# EAGLE design CP_Watsonville_South-Model (EAGLE 7.7.0)
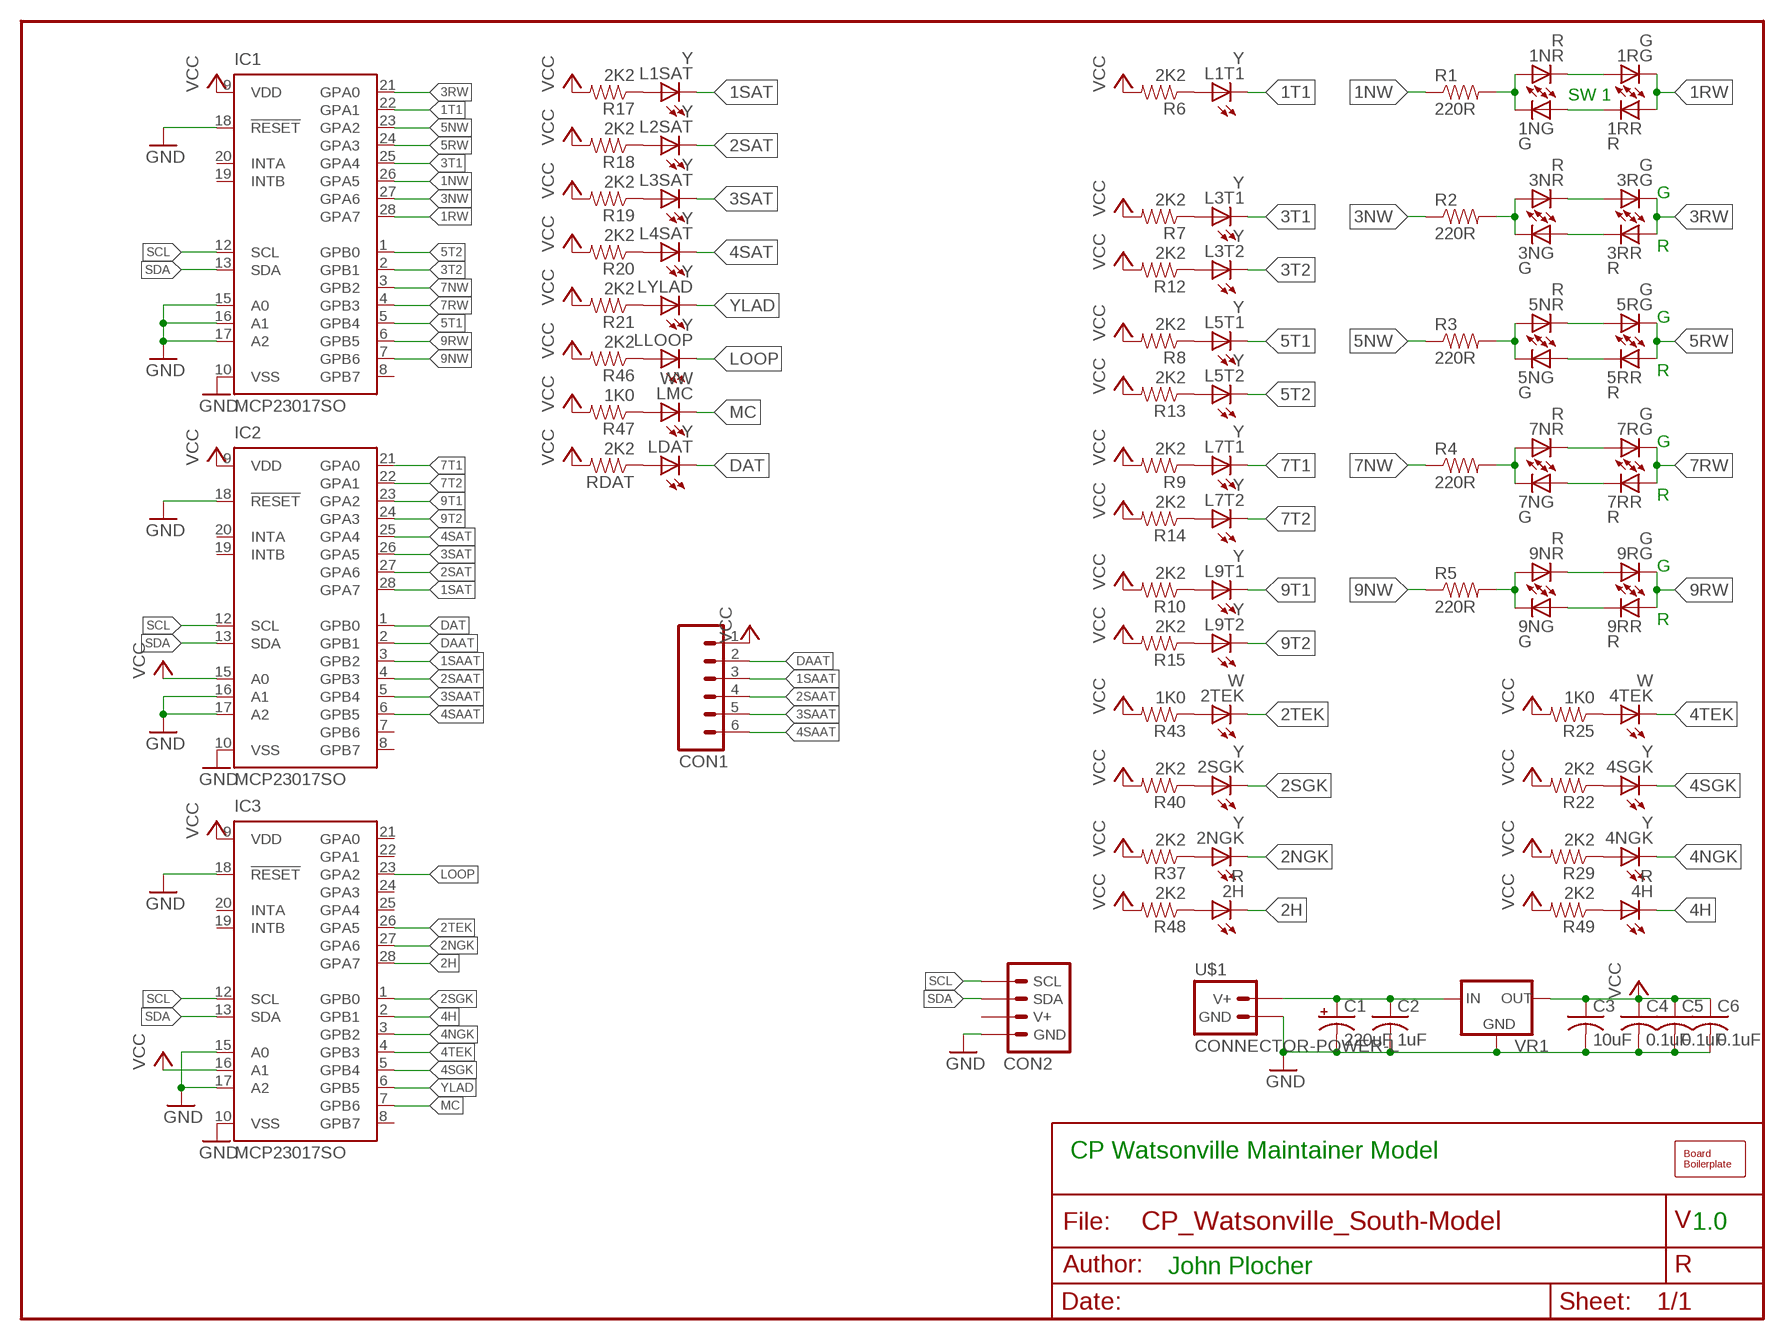
[diagram p0: schematic, sheet 1]

## Parts
1NG  G  LED0603-LED  [0603-LED]
1NR  R  LED0603-LED  [0603-LED]
1RG  G  LED0603-LED  [0603-LED]
1RR  R  LED0603-LED  [0603-LED]
2H  R  LED0603-LED  [0603-LED]
2NGK  Y  LED0603-LED  [0603-LED]
2SGK  Y  LED0603-LED  [0603-LED]
2TEK  W  LED0603-LED  [0603-LED]
3NG  G  LED0603-LED  [0603-LED]
3NR  R  LED0603-LED  [0603-LED]
3RG  G  LED0603-LED  [0603-LED]
3RR  R  LED0603-LED  [0603-LED]
4H  R  LED0603-LED  [0603-LED]
4NGK  Y  LED0603-LED  [0603-LED]
4SGK  Y  LED0603-LED  [0603-LED]
4TEK  W  LED0603-LED  [0603-LED]
5NG  G  LED0603-LED  [0603-LED]
5NR  R  LED0603-LED  [0603-LED]
5RG  G  LED0603-LED  [0603-LED]
5RR  R  LED0603-LED  [0603-LED]
7NG  G  LED0603-LED  [0603-LED]
7NR  R  LED0603-LED  [0603-LED]
7RG  G  LED0603-LED  [0603-LED]
7RR  R  LED0603-LED  [0603-LED]
9NG  G  LED0603-LED  [0603-LED]
9NR  R  LED0603-LED  [0603-LED]
9RG  G  LED0603-LED  [0603-LED]
9RR  R  LED0603-LED  [0603-LED]
BOARD1  BOARD100X150  [BOARD-SEEED10X15]
C1  220uF  CAP-POL0810  [0810-CAP]
C2  1uF  CAP0603  [0603-CAP]
C3  10uF  CAP0603  [0603-CAP]
C4  0.1uF  CAP0603  [0603-CAP]
C5  0.1uF  CAP0603  [0603-CAP]
C6  0.1uF  CAP0603  [0603-CAP]
CON1  CONNECTOR-M06LOCK  [1X06_LOCK]
CON2  CONNECTOR-I2CNOOUTLINE  [I2C-NOOUTLINE]
IC1  MCP23017SO  [SO28W]
IC2  MCP23017SO  [SO28W]
IC3  MCP23017SO  [SO28W]
L1SAT  Y  LED0603-LED  [0603-LED]
L1T1  Y  LED0603-LED  [0603-LED]
L2SAT  Y  LED0603-LED  [0603-LED]
L3SAT  Y  LED0603-LED  [0603-LED]
L3T1  Y  LED0603-LED  [0603-LED]
L3T2  Y  LED0603-LED  [0603-LED]
L4SAT  Y  LED0603-LED  [0603-LED]
L5T1  Y  LED0603-LED  [0603-LED]
L5T2  Y  LED0603-LED  [0603-LED]
L7T1  Y  LED0603-LED  [0603-LED]
L7T2  Y  LED0603-LED  [0603-LED]
L9T1  Y  LED0603-LED  [0603-LED]
L9T2  Y  LED0603-LED  [0603-LED]
LDAT  Y  LED0603-LED  [0603-LED]
LLOOP  Y  LED0603-LED  [0603-LED]
LMC  WW  LED0603-LED  [0603-LED]
LYLAD  Y  LED0603-LED  [0603-LED]
R1  220R  R0603-RES  [0603-RES]
R2  220R  R0603-RES  [0603-RES]
R3  220R  R0603-RES  [0603-RES]
R4  220R  R0603-RES  [0603-RES]
R5  220R  R0603-RES  [0603-RES]
R6  2K2  R0603-RES  [0603-RES]
R7  2K2  R0603-RES  [0603-RES]
R8  2K2  R0603-RES  [0603-RES]
R9  2K2  R0603-RES  [0603-RES]
R10  2K2  R0603-RES  [0603-RES]
R12  2K2  R0603-RES  [0603-RES]
R13  2K2  R0603-RES  [0603-RES]
R14  2K2  R0603-RES  [0603-RES]
R15  2K2  R0603-RES  [0603-RES]
R17  2K2  R0603-RES  [0603-RES]
R18  2K2  R0603-RES  [0603-RES]
R19  2K2  R0603-RES  [0603-RES]
R20  2K2  R0603-RES  [0603-RES]
R21  2K2  R0603-RES  [0603-RES]
R22  2K2  R0603-RES  [0603-RES]
R25  1K0  R0603-RES  [0603-RES]
R29  2K2  R0603-RES  [0603-RES]
R37  2K2  R0603-RES  [0603-RES]
R40  2K2  R0603-RES  [0603-RES]
R43  1K0  R0603-RES  [0603-RES]
R46  2K2  R0603-RES  [0603-RES]
R47  1K0  R0603-RES  [0603-RES]
R48  2K2  R0603-RES  [0603-RES]
R49  2K2  R0603-RES  [0603-RES]
RDAT  2K2  R0603-RES  [0603-RES]
U$1  CONNECTOR-POWER-L  [POWER-R2]
VR1  VREG-DPAK-5  [TO-252]

## Nets
1NW: IC1.26(GPA5) R1.1
1RW: 1RG.C 1RR.A IC1.28(GPA7)
1SAAT: CON1.3 IC2.3(GPB2)
1SAT: IC2.28(GPA7) L1SAT.C
1T1: IC1.22(GPA1) L1T1.C
2H: 2H.C IC3.28(GPA7)
2NGK: 2NGK.C IC3.27(GPA6)
2SAAT: CON1.4 IC2.4(GPB3)
2SAT: IC2.27(GPA6) L2SAT.C
2SGK: 2SGK.C IC3.1(GPB0)
2TEK: 2TEK.C IC3.26(GPA5)
3NW: IC1.27(GPA6) R2.1
3RW: 3RG.C 3RR.A IC1.21(GPA0)
3SAAT: CON1.5 IC2.5(GPB4)
3SAT: IC2.26(GPA5) L3SAT.C
3T1: IC1.25(GPA4) L3T1.C
3T2: IC1.2(GPB1) L3T2.C
4H: 4H.C IC3.2(GPB1)
4NGK: 4NGK.C IC3.3(GPB2)
4SAAT: CON1.6 IC2.6(GPB5)
4SAT: IC2.25(GPA4) L4SAT.C
4SGK: 4SGK.C IC3.5(GPB4)
4TEK: 4TEK.C IC3.4(GPB3)
5NW: IC1.23(GPA2) R3.1
5RW: 5RG.C 5RR.A IC1.24(GPA3)
5T1: IC1.5(GPB4) L5T1.C
5T2: IC1.1(GPB0) L5T2.C
7NW: IC1.3(GPB2) R4.1
7RW: 7RG.C 7RR.A IC1.4(GPB3)
7T1: IC2.21(GPA0) L7T1.C
7T2: IC2.22(GPA1) L7T2.C
9NW: IC1.7(GPB6) R5.1
9RW: 9RG.C 9RR.A IC1.6(GPB5)
9T1: IC2.23(GPA2) L9T1.C
9T2: IC2.24(GPA3) L9T2.C
DAAT: CON1.2 IC2.2(GPB1)
DAT: IC2.1(GPB0) LDAT.C
GND [power]: C1.- C2.2 C3.2 C4.2 C5.2 C6.2 CON2.GND IC1.10(VSS) IC1.15(A0) IC1.16(A1) IC1.17(A2) IC1.18(!RESET) IC2.10(VSS) IC2.16(A1) IC2.17(A2) IC2.18(!RESET) IC3.10(VSS) IC3.15(A0) IC3.17(A2) IC3.18(!RESET) U$1.GND U$1.GND@1(GND) U$1.GND@2(GND) U$1.GND@3(GND) VR1.2(GND)
LOOP: IC3.23(GPA2) LLOOP.C
MC: IC3.7(GPB6) LMC.C
N$1: 3NR.C 3RG.A
N$2: 3NG.A 3RR.C
N$3: 1NG.C 1NR.A R1.2
N$4: L1T1.A R6.1
N$5: L3T1.A R7.1
N$8: 3NG.C 3NR.A R2.2
N$11: 5NG.C 5NR.A R3.2
N$14: 7NG.C 7NR.A R4.2
N$17: 9NG.C 9NR.A R5.2
N$18: L5T1.A R8.1
N$19: L7T1.A R9.1
N$20: L9T1.A R10.1
N$21: 1NR.C 1RG.A
N$22: L3T2.A R12.1
N$23: L5T2.A R13.1
N$24: L7T2.A R14.1
N$25: L9T2.A R15.1
N$26: LDAT.A RDAT.1
N$27: L1SAT.A R17.1
N$28: L2SAT.A R18.1
N$29: L3SAT.A R19.1
N$30: L4SAT.A R20.1
N$31: LYLAD.A R21.1
N$32: 4SGK.A R22.1
N$33: 1NG.A 1RR.C
N$34: 5NR.C 5RG.A
N$35: 4TEK.A R25.1
N$36: 5NG.A 5RR.C
N$37: 7NR.C 7RG.A
N$38: 7NG.A 7RR.C
N$39: 4NGK.A R29.1
N$40: 9NR.C 9RG.A
N$41: 9NG.A 9RR.C
N$47: 2NGK.A R37.1
N$50: 2SGK.A R40.1
N$53: 2TEK.A R43.1
N$56: LLOOP.A R46.1
N$57: LMC.A R47.1
N$58: 2H.A R48.1
N$59: 4H.A R49.1
SCL: CON2.SCL IC1.12(SCL) IC2.12(SCL) IC3.12(SCL)
SDA: CON2.SDA IC1.13(SDA) IC2.13(SDA) IC3.13(SDA)
VCC [power]: C3.1 C4.1 C5.1 C6.1 CON1.1 IC1.9(VDD) IC2.9(VDD) IC2.15(A0) IC3.9(VDD) IC3.16(A1) R6.2 R7.2 R8.2 R9.2 R10.2 R12.2 R13.2 R14.2 R15.2 R17.2 R18.2 R19.2 R20.2 R21.2 R22.2 R25.2 R29.2 R37.2 R40.2 R43.2 R46.2 R47.2 R48.2 R49.2 RDAT.2 VR1.3(OUT)
VIN [power]: C1.+ C2.1 U$1.V+ U$1.V+@1(V+) U$1.V+@2(V+) U$1.V+@3(V+) VR1.1(IN)
YLAD: IC3.6(GPB5) LYLAD.C
Unconnected: CON2.V+ IC1.8(GPB7) IC1.19(INTB) IC1.20(INTA) IC2.7(GPB6) IC2.8(GPB7) IC2.19(INTB) IC2.20(INTA) IC3.8(GPB7) IC3.19(INTB) IC3.20(INTA) IC3.21(GPA0) IC3.22(GPA1) IC3.24(GPA3) IC3.25(GPA4)

## Notes on the sheet
- SW 1
- G
- R
- G
- R
- G
- R
- G
- R
- CP Watsonville Maintainer Model
- 1.0
- John Plocher

## Library data of the parts
1NG 1NR 1RG 1RR 2H 2NGK 2SGK 2TEK 3NG 3NR 3RG 3RR 4H 4NGK 4SGK 4TEK 5NG 5NR 5RG 5RR 7NG 7NR 7RG 7RR 9NG 9NR 9RG 9RR L1SAT L1T1 L2SAT L3SAT L3T1 L3T2 L4SAT L5T1 L5T2 L7T1 L7T2 L9T1 L9T2 LDAT LLOOP LMC LYLAD = SPCoast:LED*
BOARD1 = SPCoast:BOARD
C1 = SPCoast:CAP-POL*
C2-C6 = SPCoast:CAP*
CON1 = SPCoast:CONNECTOR-M06: Header 6 Standard 6-pin 0.1" header
CON2 = SPCoast:CONNECTOR-I2C
IC1-IC3 = SPCoast:MCP23017: http://ww1.microchip.com/downloads/en/DeviceDoc/21952a.pdf Source: http://ww1.microchip.com/downloads/en/DeviceDoc/21952a.pdf; MF: MICROCHIP; MPN: MCP23017-E/SO; OC_FARNELL: 1332087; OC_NEWARK: 31K2958
R1-R10 R12-R15 R17-R22 R25 R29 R37 R40 R43 R46-R49 RDAT = SPCoast:R*: Resistor Basic schematic elements and footprints for 0603, 1206, and PTH 1/10th watt (small) resistors.
U$1 = SPCoast:CONNECTOR-POWER
VR1 = SPCoast:VREG-?-*: Voltage Regulator Standard linear regulator. 7805 uses IGO pinout LM1117 uses GOI pinout

## Net classes
0 default: width 0.152 mm, drill 0.4 mm
1 power: width 0.61 mm, drill 1 mm

## Board
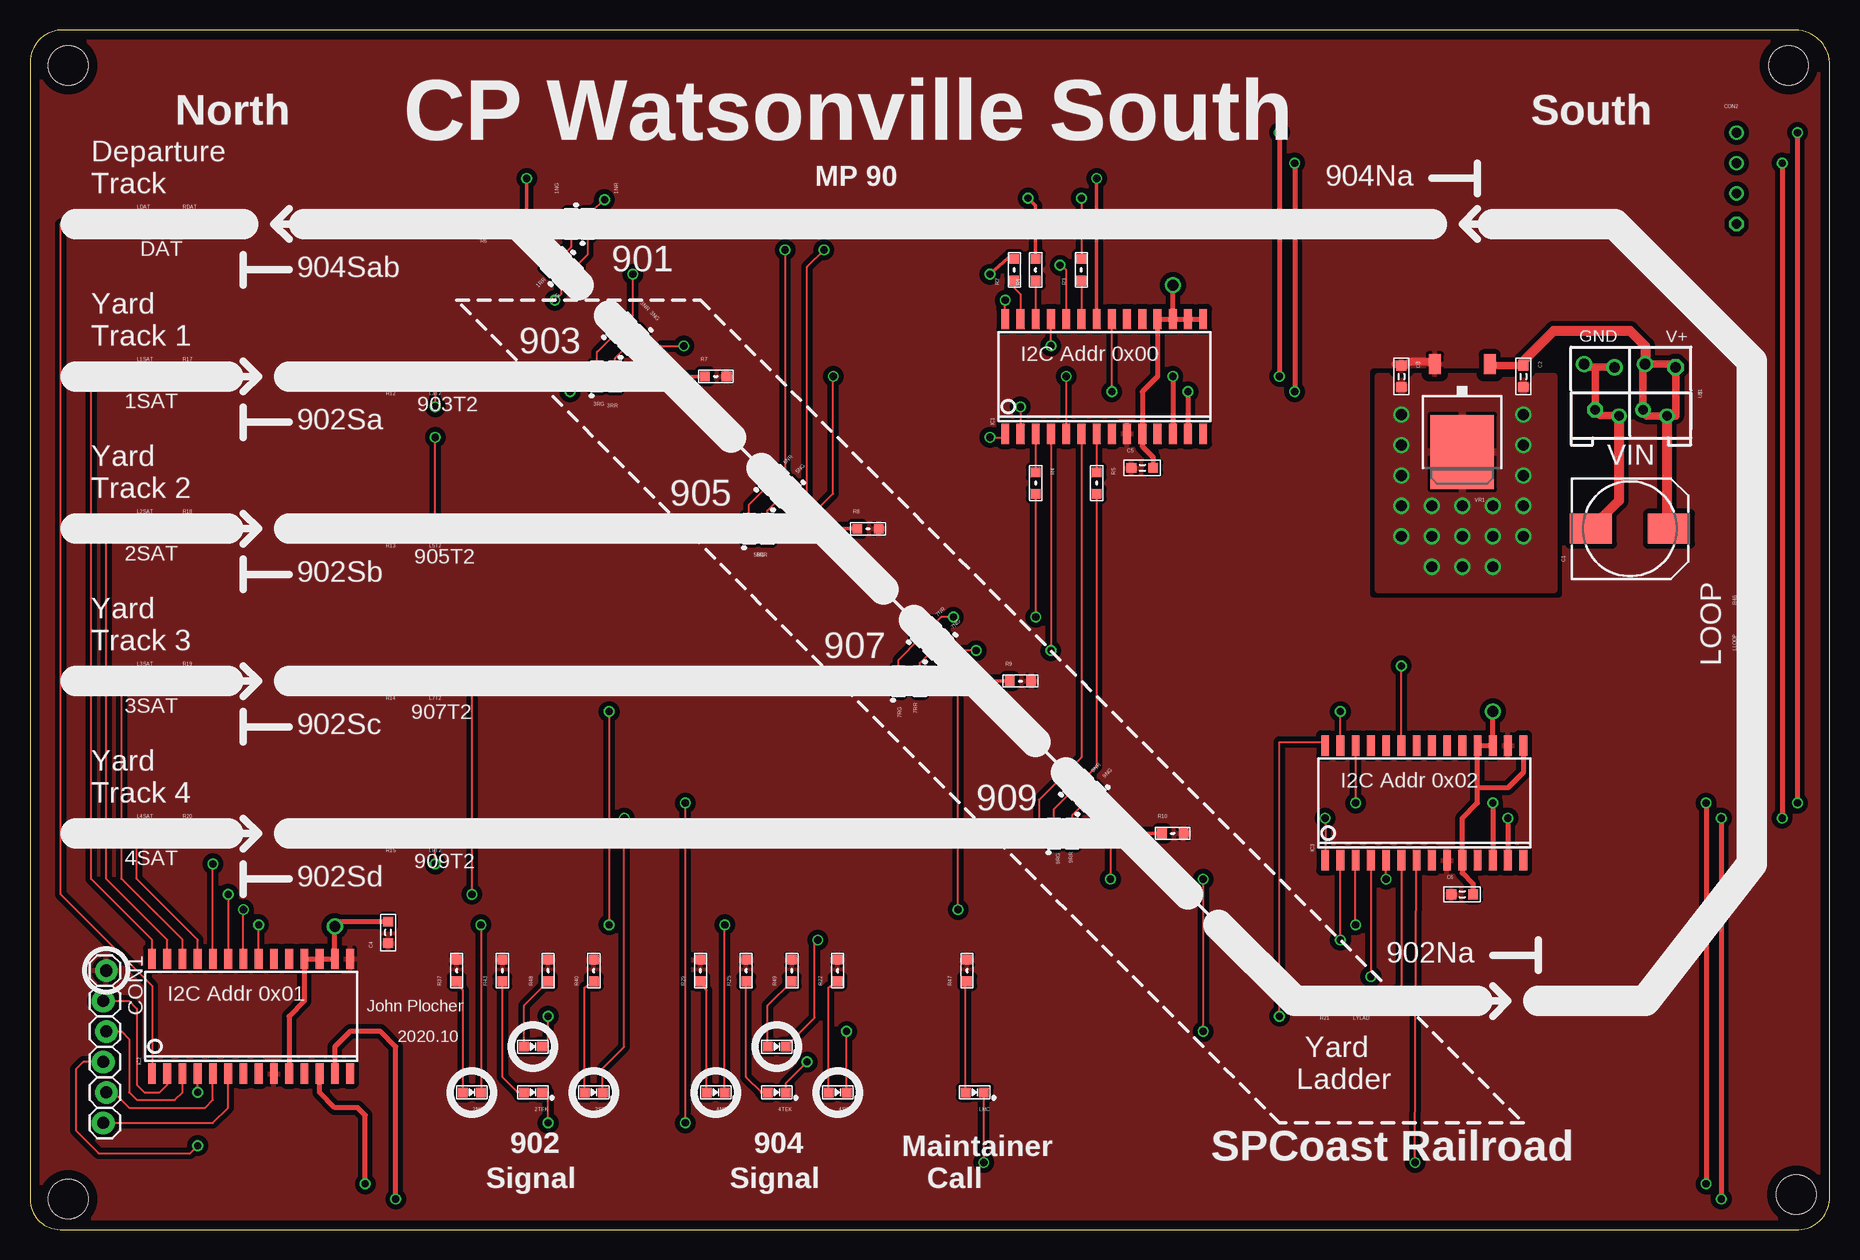
[diagram p1: board, top side]
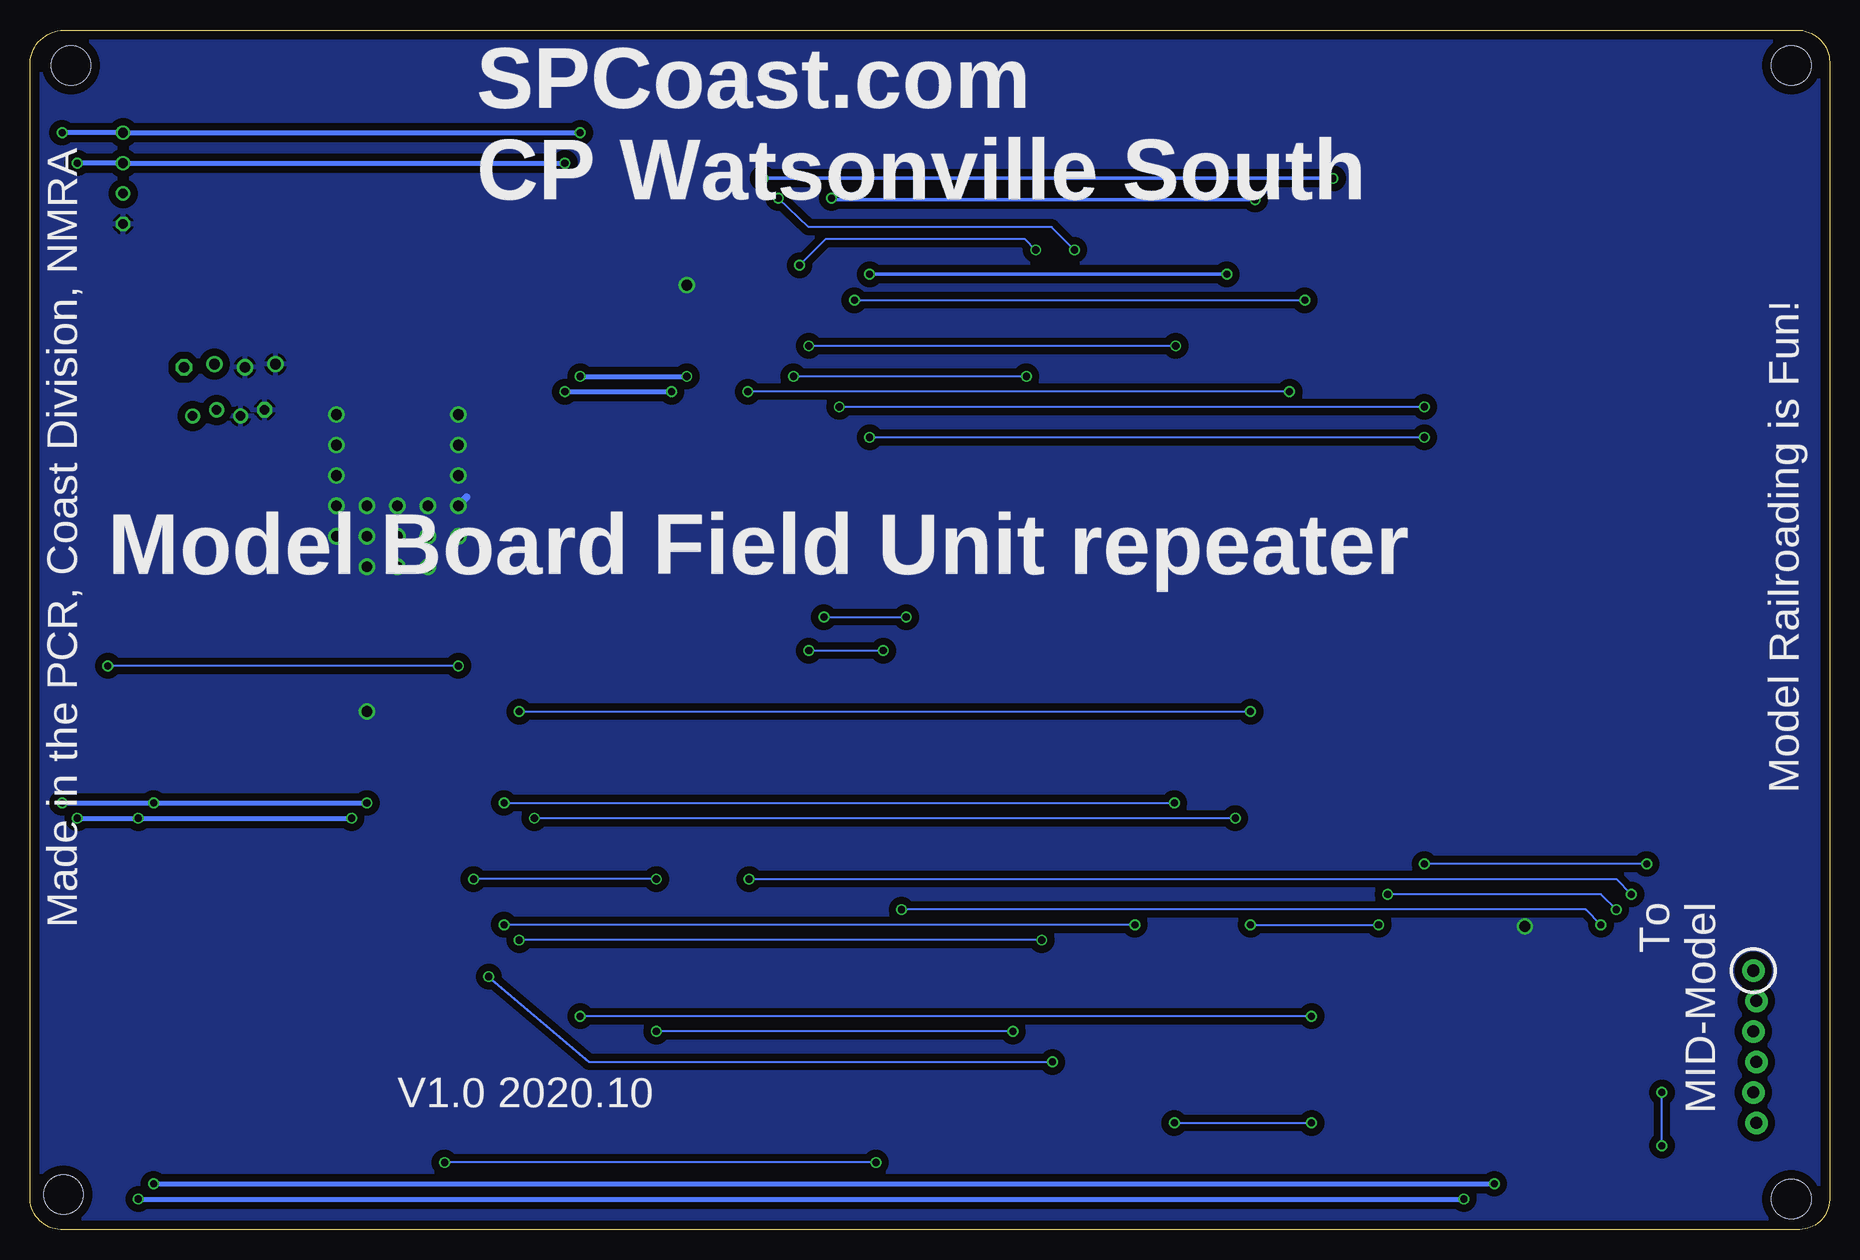
[diagram p2: board, bottom side, seen from below]

Size 150.01 x 100 mm. Coordinates in mm from the lower left corner, seen from the top.
Copper layers (1*16): Top 0.035mm / dielectric 1.5mm / Bottom 0.035mm
Design rules "jlcpcb *": minimum track width 5mil, minimum drill 0.3mm, track to track 5mil, track to pad 0.2mm, pad to pad 0.54mm, via to via 0.54mm, smd to smd 5mil, copper to edge 30mil, drill to drill 10mil, minimum pad ring 0.13mm, minimum via ring 0.13mm, stop-mask expansion 4mil, vias tented up to drill 0mil, thermal gap 10mil

### Footprints (pad centres in the part's own frame; a part is rotated, then mirrored left to right if it is on the bottom)
0603-LED = smd 0.8 x 0.8: A 0.75,0; C -0.75,0
BOARD-SEEED10X15 = hole 3.3: 147.216,2.921; 3.175,97.04; 146.581,97.04; 3.175,2.54
0810-CAP = smd 3.5 x 2.5: + 3.25,0; - -3.25,0
0603-CAP = smd 0.813 x 0.813: 1 -0.9,0; 2 0.9,0
1X06_LOCK = drill 1.016 pad 1.88: 1 0,0; 2 2.54,-0.254; 3 5.08,0; 4 7.62,-0.254; 5 10.16,0; 6 12.7,-0.254
I2C-NOOUTLINE = drill 0.8 octagon: GND 3.81,0 | drill 0.8: SCL -3.81,0; SDA -1.27,0; V+ 1.27,0
SO28W = smd 0.65 x 1.7: 1 -7.62,-4.78; 2 -6.35,-4.78; 3 -5.08,-4.78; 4 -3.81,-4.78; 5 -2.54,-4.78; 6 -1.27,-4.78; 7 0,-4.78; 8 1.27,-4.78; 9 2.54,-4.78; 10 3.81,-4.78; 11 5.08,-4.78; 12 6.35,-4.78; 13 7.62,-4.78; 14 8.89,-4.78; 15 8.89,4.78; 16 7.62,4.78; 17 6.35,4.78; 18 5.08,4.78; 19 3.81,4.78; 20 2.54,4.78; 21 1.27,4.78; 22 0,4.78; 23 -1.27,4.78; 24 -2.54,4.78; 25 -3.81,4.78; 26 -5.08,4.78; 27 -6.35,4.78; 28 -7.62,4.78
0603-RES = smd 0.813 x 0.813: 1 -0.9,0; 2 0.9,0
POWER-R2 = drill 0.9: GND -3.302,-1.27; GND@1 -3.556,-3.81; V+ -3.556,1.27 | drill 0.8 pad 1.27: GND@2 0.762,-0.904; V+@2 0.762,3.096; V+@3 0.254,1.096 | drill 0.8 pad 1.27 octagon: GND@3 0.254,-2.904 | drill 0.9 octagon: V+@1 -3.302,3.81
TO-252 = smd 1.651 x 1.016: 1 -4.826,2.286; 3 -4.826,-2.286 | smd 6.2 x 5.3: 2 2.5,0

### Placement (x,y rotation side)
1NG  45.09,83.82 270 top
1NR  46.49,83.82 90 top
1RG  44.84,79.63 45 top
1RR  43.82,80.65 225 top
2H  41.92,15.24 180 top
2NGK  36.84,11.43 180 top
2SGK  47,11.43 180 top
2TEK  41.92,11.43 180 top
3NG  50.3,74.17 225 top
3NR  49.29,75.19 45 top
3RG  47.25,71.12 90 top
3RR  48.78,71.12 270 top
4H  62.24,15.24 180 top
4NGK  57.16,11.43 180 top
4SGK  67.32,11.43 180 top
4TEK  62.24,11.43 180 top
5NG  63,61.47 225 top
5NR  61.99,62.49 45 top
5RG  59.95,58.42 90 top
5RR  61.48,58.42 270 top
7NG  75.7,48.77 225 top
7NR  74.69,49.79 45 top
7RG  72.4,45.72 90 top
7RR  74.18,45.72 270 top
9NG  88.4,36.07 225 top
9NR  87.39,37.09 45 top
9RG  85.35,33.02 90 top
9RR  86.88,33.02 270 top
BOARD1  0.01,0 0 top
C1  133.36,58.42 0 top
C2  124.47,71.12 270 top
C3  114.31,71.12 270 top
C4  29.85,24.77 90 top
C5  92.72,63.5 0 top
C6  119.39,27.94 0 top
CON1  6.36,21.59 270 top
CON2  142.25,87.63 270 top
IC1  88.91,71.12 0 top
IC2  17.79,17.78 0 top
IC3  115.58,35.56 0 top
L1SAT  10.17,71.12 0 top
L1T1  40.65,83.82 180 top
L2SAT  10.17,58.42 0 top
L3SAT  10.17,45.72 0 top
L3T1  52.71,71.12 0 top
L3T2  33.03,71.12 180 top
L4SAT  10.17,33.02 0 top
L5T1  65.41,58.42 0 top
L5T2  33.03,58.42 180 top
L7T1  78.11,45.72 0 top
L7T2  33.03,45.72 180 top
L9T1  90.81,33.02 0 top
L9T2  33.03,33.02 180 top
LDAT  10.17,83.82 0 top
LLOOP  143.52,49.53 90 top
LMC  78.75,11.43 180 top
LYLAD  110.37,19.05 180 top
R1  83.83,80.01 90 top
R2  82.05,80.01 90 top
R3  87.64,80.01 90 top
R4  83.83,62.23 270 top
R5  88.91,62.23 270 top
R6  36.84,83.82 180 top
R7  57.16,71.12 0 top
R8  69.86,58.42 0 top
R9  82.56,45.72 0 top
R10  95.26,33.02 0 top
R12  29.22,71.12 180 top
R13  29.22,58.42 180 top
R14  29.22,45.72 180 top
R15  29.22,33.02 180 top
R17  13.98,71.12 0 top
R18  13.98,58.42 0 top
R19  13.98,45.72 0 top
R20  13.98,33.02 0 top
R21  107.07,19.05 180 top
R22  67.32,21.59 90 top
R25  59.7,21.59 90 top
R29  55.89,21.59 90 top
R37  35.57,21.59 90 top
R40  47,21.59 90 top
R43  39.38,21.59 90 top
R46  143.52,53.34 90 top
R47  78.11,21.59 90 top
R48  43.19,21.59 90 top
R49  63.51,21.59 90 top
RDAT  13.98,83.82 0 top
U$1  133.36,68.58 270 top
VR1  119.39,67.31 270 top

### Tracks (layer width: path | path; a pad name or v marks a point on that pad's centre or on a via)
1NW
  Top 0.152: R1.1 IC1.26
1RW  (via drill 0.6)
  Top 0.152: IC1.28 v81.29,77.47 | 1RR.A 1RG.C 44.31,78.03 v43.75,77.47
  Bottom 0.152: v81.29,77.47 v43.75,77.47
1SAAT
  Top 0.152: CON1.3 7.63,16.51 8.26,15.88 8.26,11.43 8.9,10.8 12.07,10.8 12.71,11.43 IC2.3
1SAT
  Top 0.152: IC2.28 10.17,24.13 5.09,29.21 5.09,71.12 L1SAT.C
1T1  (via drill 0.6)
  Top 0.305: L1T1.C v41.4,87.63 | v88.91,87.63 IC1.22
  Bottom 0.305: v41.4,87.63 v88.91,87.63
2H  (via drill 0.6)
  Top 0.152: 2H.C 43.19,15.24 v43.19,17.78 | v104.15,17.78 104.15,40.64 107.96,40.64 IC3.28
  Bottom 0.152: v43.19,17.78 v104.15,17.78
2NGK  (via drill 0.6)
  Top 0.152: IC3.27 v109.23,43.18 | v48.27,43.18 v48.27,25.4 | v37.59,25.4 2NGK.C
  Bottom 0.152: v109.23,43.18 v48.27,43.18 | v48.27,25.4 v37.59,25.4
2SAAT  (via drill 0.6)
  Top 0.152: CON1.4 4.45,13.97 3.82,13.34 3.82,8.26 5.72,6.35 13.34,6.35 v13.98,6.99 | v13.98,11.43 IC2.4
  Bottom 0.152: v13.98,6.99 v13.98,11.43
2SAT
  Top 0.152: IC2.27 11.44,24.13 6.36,29.21 6.36,58.42 L2SAT.C
2SGK  (via drill 0.6)
  Top 0.152: 2SGK.C 47.75,13.45 49.54,15.24 v49.54,34.29 | v107.96,34.29 IC3.1
  Bottom 0.152: v49.54,34.29 v107.96,34.29
2TEK  (via drill 0.6)
  Top 0.152: IC3.26 v110.5,35.56 | v54.62,35.56 v54.62,8.89 | v43.19,8.89 43.19,11.43 2TEK.C
  Bottom 0.152: v110.5,35.56 v54.62,35.56 | v54.62,8.89 v43.19,8.89
3NW
  Top 0.152: R2.1 82.05,78.49 82.56,77.98 IC1.27
3RW  (via drill 0.6)
  Top 0.152: v90.18,69.85 IC1.21 | v45.02,69.85 45.54,70.37 3RG.C 3RR.A
  Bottom 0.152: v45.02,69.85 v90.18,69.85
3SAAT
  Top 0.152: CON1.5 6.99,11.43 8.26,10.16 14.61,10.16 15.25,10.8 IC2.5
3SAT
  Top 0.152: IC2.26 12.71,24.13 7.63,29.21 7.63,45.72 L3SAT.C
3T1  (via drill 0.6)
  Top 0.152: L3T1.C 51.96,73.04 52.59,73.66 v54.5,73.66 | v85.1,73.66 IC1.25
  Bottom 0.152: v54.5,73.66 v85.1,73.66
3T2  (via drill 0.6)
  Top 0.152: L3T2.C v33.78,68.58 | v82.56,68.58 IC1.2
  Bottom 0.152: v33.78,68.58 v82.56,68.58
4H  (via drill 0.6)
  Top 0.152: 4H.C 65.41,17.67 65.41,23.88 v65.67,24.13 | v109.23,24.13 IC3.2
  Bottom 0.152: v65.67,24.13 v109.23,24.13
4NGK  (via drill 0.6)
  Top 0.152: 4NGK.C v57.91,25.4 | v110.5,25.4 IC3.3
  Bottom 0.152: v57.91,25.4 v110.5,25.4
4SAAT
  Top 0.152: CON1.6 15.25,8.89 16.52,10.16 IC2.6
4SAT
  Top 0.152: IC2.25 13.98,24.13 8.9,29.21 8.9,33.02
  Top 0.305: 8.9,33.02 L4SAT.C
4SGK  (via drill 0.6)
  Top 0.152: 4SGK.C v68.07,16.51 | v97.8,16.51 v97.8,29.21 | v113.04,29.21 IC3.5
  Bottom 0.152: v68.07,16.51 v97.8,16.51 | v97.8,29.21 v113.04,29.21
4TEK  (via drill 0.6)
  Top 0.152: IC3.4 v111.77,21.09 | v64.78,13.97 62.99,12.18 4TEK.C
  Bottom 0.152: v111.77,21.09 103.39,13.97 v64.78,13.97
5NW
  Top 0.152: R3.1 IC1.23
5RW  (via drill 0.6)
  Top 0.152: v66.18,81.66 64.78,80.27 64.78,61.22 62.75,59.19 62.75,58.17 62.24,57.66 61.49,57.66 5RR.A 5RG.C | v85.86,80.39 85.99,80.39 86.37,80.01 IC1.24
  Bottom 0.152: v66.18,81.66 67.07,82.55 83.7,82.55 v85.86,80.39
5T1  (via drill 0.6)
  Top 0.152: L5T1.C 64.65,58.44 64.65,59.06 66.94,61.34 v66.95,71.12 | v86.37,71.12 IC1.5
  Bottom 0.152: v66.95,71.12 v86.37,71.12
5T2  (via drill 0.6)
  Top 0.152: L5T2.C v33.78,66.04 | v80.02,66.04 81.29,66.04
  Top 0.305: 81.29,66.04 IC1.1
  Bottom 0.152: v33.78,66.04 v80.02,66.04
7NW
  Top 0.152: IC1.3 R4.1
7RW  (via drill 0.6)
  Top 0.152: IC1.4 v85.1,48.26 | v78.88,48.26 77.48,48.26 75.45,46.23 75.45,45.47 74.95,44.97 7RR.A 7RG.C
  Bottom 0.152: v85.1,48.26 v78.88,48.26
7T1  (via drill 0.6)
  Top 0.152: IC2.21 v19.06,25.4 | v77.36,26.67 L7T1.C
  Bottom 0.152: v19.06,25.4 20.33,26.67 v77.36,26.67
7T2  (via drill 0.6)
  Top 0.152: IC2.22 v17.79,26.67 | v36.84,27.94 36.84,45.72 L7T2.C
  Bottom 0.152: v17.79,26.67 19.06,27.94 v36.84,27.94
9NW
  Top 0.152: IC1.7 R5.1
9RW
  Top 0.152: IC1.6 87.64,39.37 84.08,35.82 84.08,32.77 84.59,32.26 85.34,32.26 9RG.C 9RR.A
9T1  (via drill 0.6)
  Top 0.152: L9T1.C v90.06,29.21 | v16.52,27.94 IC2.23
  Bottom 0.152: v90.06,29.21 17.79,29.21 v16.52,27.94
9T2  (via drill 0.6)
  Top 0.152: IC2.24 v15.25,30.48 | v33.78,30.48 L9T2.C
  Bottom 0.152: v15.25,30.48 v33.78,30.48
DAAT
  Top 0.152: CON1.2 8.26,19.05 8.9,18.42 8.9,12.07 9.53,11.43 10.8,11.43 11.44,12.07 IC2.2
DAT
  Top 0.152: LDAT.C 2.55,83.82 2.55,27.94 10.17,20.32 IC2.1
GND  (via drill 0.9)
  Top 0.406: IC1.17 IC1.18 93.99,71.12 92.72,69.85 IC1.10 92.72,65.28 93.61,64.39 93.61,63.51 C5.2 | IC1.17 IC1.16 IC1.15 | IC2.10 21.6,17.78 22.87,19.05 IC2.18 IC2.17 IC2.16 v25.41,25.28 25.8,25.67 C4.2 | 120.66,36.83 120.66,35.56 119.39,34.29 IC3.10 119.39,29.72 120.28,28.83 120.28,27.95 C6.2 | 120.66,36.83 IC3.18 IC3.17 v121.93,43.18 | IC3.15 124.47,38.1 123.2,36.83 120.66,36.83 | IC1.17 v95.26,78.74
  Top 0.61: C2.2 124.66,70.41 | U$1.GND@2 132.45,67.86 130.91,67.86 130.49,68.28 U$1.GND@3 130.49,68.63 130.49,71.91 | 130.49,71.91 129.79,71.91 129.58,72.12 U$1.GND@1 | 130.49,71.91 132.03,71.91 U$1.GND
  Top 0.813: U$1.GND@2 132.46,60.77 C1.-
  Bottom 0.61: 113.6,61.06 114.3,60.36 v114.31,60.33
  other vias: 114.31,67.95 114.31,65.41 114.31,62.87 116.85,60.33 119.39,60.33 121.93,60.33 124.47,60.33 124.47,62.87 124.47,65.41 124.47,67.95 124.47,57.79 121.93,55.25 121.93,57.79 119.39,57.79 116.85,57.79 114.31,57.79 119.39,55.25 116.85,55.25
  pour Bottom (isolate 0.61): 0.01,100.33 0.01,0 149.87,0 149.87,100.33
  pour Top (isolate 0.61): 127.01,71.12 112.4,71.12 112.4,53.34 127.01,53.34
LOOP  (via drill 0.6)
  Top 0.152: IC3.23 v114.31,46.99 | v143.52,46.99 LLOOP.C
  Bottom 0.152: v114.31,46.99 v143.52,46.99
MC  (via drill 0.6)
  Top 0.152: 79.52,11.39 LMC.C v79.5,5.59 | v115.45,5.59 IC3.7
  Bottom 0.152: v79.5,5.59 v115.45,5.59
N$1
  Top 0.152: 3RG.A 47.25,73.16 3NR.C
N$2
  Top 0.152: 3RR.C 48.78,72.65 3NG.A
N$3  (via drill 0.6)
  Top 0.152: 1NG.C 1NR.A 46.76,84.84 v47.89,85.86
  Top 0.305: R1.2 83.83,85.35 v83.19,85.98
  Bottom 0.305: v47.89,85.86 83.07,85.86 v83.19,85.98
N$4
  Top 0.305: R6.1 L1T1.A
N$5
  Top 0.305: L3T1.A R7.1
N$8  (via drill 0.6)
  Top 0.152: 3NG.C 3NR.A 50.25,76.15 v50.25,79.64
  Top 0.305: v80.02,79.64 81.54,81.03 81.94,81.03 R2.2
  Bottom 0.305: v50.25,79.64 v80.02,79.64
N$11  (via drill 0.6)
  Top 0.152: v87.64,85.98 R3.2 | v62.95,81.66 62.95,63.45 5NR.A 5NG.C
  Bottom 0.152: v62.95,81.66 64.85,83.57 85.1,83.57 v87.64,85.98
N$14  (via drill 0.6)
  Top 0.152: R4.2 v83.83,51.06 | 7NG.C 7NR.A 75.96,51.06 v76.97,51.06
  Bottom 0.152: v83.83,51.06 v76.97,51.06
N$17
  Top 0.152: R5.2 88.91,38.61 9NR.A 9NG.C
N$18
  Top 0.305: L5T1.A R8.1
N$19
  Top 0.305: L7T1.A R9.1
N$20
  Top 0.305: L9T1.A R10.1
N$21
  Top 0.152: 1NR.C 46.49,81.28 1RG.A
N$22
  Top 0.305: R12.1 L3T2.A
N$23
  Top 0.305: R13.1 L5T2.A
N$24
  Top 0.305: R14.1 L7T2.A
N$25
  Top 0.305: R15.1 L9T2.A
N$26
  Top 0.305: LDAT.A RDAT.1
N$27
  Top 0.305: R17.1 L1SAT.A
N$28
  Top 0.305: R18.1 L2SAT.A
N$29
  Top 0.305: R19.1 L3SAT.A
N$30
  Top 0.305: R20.1 L4SAT.A
N$31
  Top 0.152: R21.1 LYLAD.A
N$32
  Top 0.152: 4SGK.A 66.57,20.17 R22.1
N$33
  Top 0.152: 1NG.A 45.09,81.92 1RR.C
N$34
  Top 0.152: 5RG.A 59.95,60.46 5NR.C
N$35
  Top 0.152: 60.97,11.43 59.7,12.7 R25.1
  Top 0.254: 4TEK.A 60.97,11.43
N$36
  Top 0.152: 5RR.C 61.48,59.95 5NG.A
N$37
  Top 0.152: 7RG.A 72.4,47.5 7NR.C
N$38
  Top 0.152: 7RR.C 74.18,47.25 7NG.A
N$39
  Top 0.152: 4NGK.A 56.41,19.94 R29.1
N$40
  Top 0.152: 9RG.A 85.35,35.06 9NR.C
N$41
  Top 0.152: 9RR.C 86.88,34.55 9NG.A
N$47
  Top 0.152: 2NGK.A 36.09,19.94 R37.1
N$50
  Top 0.152: 2SGK.A 46.25,20.17 R40.1
N$53
  Top 0.152: 40.65,11.43 39.38,12.7 R43.1
  Top 0.254: 2TEK.A 40.65,11.43
N$56
  Top 0.152: R46.1 LLOOP.A
N$57
  Top 0.152: LMC.A 78,20.58
  Top 0.254: 78,20.58 R47.1
N$58
  Top 0.152: 2H.A 41.17,18.67 R48.1
N$59
  Top 0.152: 4H.A 61.49,18.67 R49.1
SCL  (via drill 0.6)
  Top 0.406: v104.15,91.44 v104.15,71.12 | v95.26,71.12 IC1.12 | v121.93,35.56 IC3.12 | v139.71,35.56 v139.71,3.81 | v27.95,3.81 27.95,9.53 27.31,10.16 25.41,10.16 24.14,11.43 IC2.12 | v147.33,91.44 v147.33,35.56
  Bottom 0.406: v104.15,91.44 CON2.SCL v147.33,91.44 | v104.15,71.12 v95.26,71.12 | v121.93,35.56 v139.71,35.56 v147.33,35.56 | v139.71,3.81 v27.95,3.81
SDA  (via drill 0.6)
  Top 0.406: v105.42,88.9 v105.42,69.85 | v96.53,69.85 IC1.13 | v123.2,34.29 IC3.13 | v140.98,34.29 v140.98,2.54 | v30.49,2.54 30.49,15.24 29.22,16.51 26.68,16.51 25.41,15.24 IC2.13 | v146.06,88.9 v146.06,34.29
  Bottom 0.406: v105.42,88.9 CON2.SDA v146.06,88.9 | v105.42,69.85 v96.53,69.85 | v123.2,34.29 v140.98,34.29 v146.06,34.29 | v140.98,2.54 v30.49,2.54
VCC
  Top 0.61: VR1.3 117.1,72.16 116.89,72.37 115,72.37 114.65,72.03 114.37,72.03 C3.1 114.02,72.16 113.81,72.16 | 67.58,22.5 R22.2 | 35.45,22.77 R37.2
  pour Top (isolate 0.406, rank 2): 0.01,99.83 0.01,0 149.87,0 149.87,99.83
VIN
  Top 0.61: U$1.V+@3 134.46,71.97 U$1.V+ 137.17,72.14 U$1.V+@1 137.17,67.82 U$1.V+@2 134.76,67.82 134.63,67.95 | VR1.1 121.79,72.02 C2.1
  Top 0.813: U$1.V+@2 136.46,58.58 C1.+ | C2.1 124.47,72.39 127.01,74.93 133.36,74.93 134.63,73.66 U$1.V+
YLAD
  Top 0.152: IC3.6 114.31,20.32 113.04,19.05 LYLAD.C

### Text on the board
tPlace: North | South | CP Watsonville South | MP 90 | 904Na | Departure / Track | 901 | DAT | 904Sab | Yard / Track 1 | 903 | I2C Addr 0x00 | 1SAT | 903T2 | 902Sa | Yard / Track 2 | 905 | 2SAT | 905T2 | 902Sb | Yard / Track 3 | 907 | LOOP | 3SAT | 907T2 | 902Sc | I2C Addr 0x02 | Yard / Track 4 | 909 | 4SAT | 909T2 | 902Sd | 902Na | I2C Addr 0x01 | John Plocher | 2020.10 | Yard / Ladder | 902 | 904 | SPCoast Railroad | Signal | Signal | Maintainer / Call
bPlace: Made in the PCR, Coast Division, NMRA | SPCoast.com / CP Watsonville South | Model Railroading is Fun! | Model Board Field Unit repeater | To / MID-Model | V1.0 2020.10